# Altium schematic sheet LCD.SchDoc: HD44780 display connector
size A4; DrawnBy: Grzegorz Gajoch; Address1: Grzegorz Gajoch; Address2: grzegorz@gajoch.pl; Revision: 1
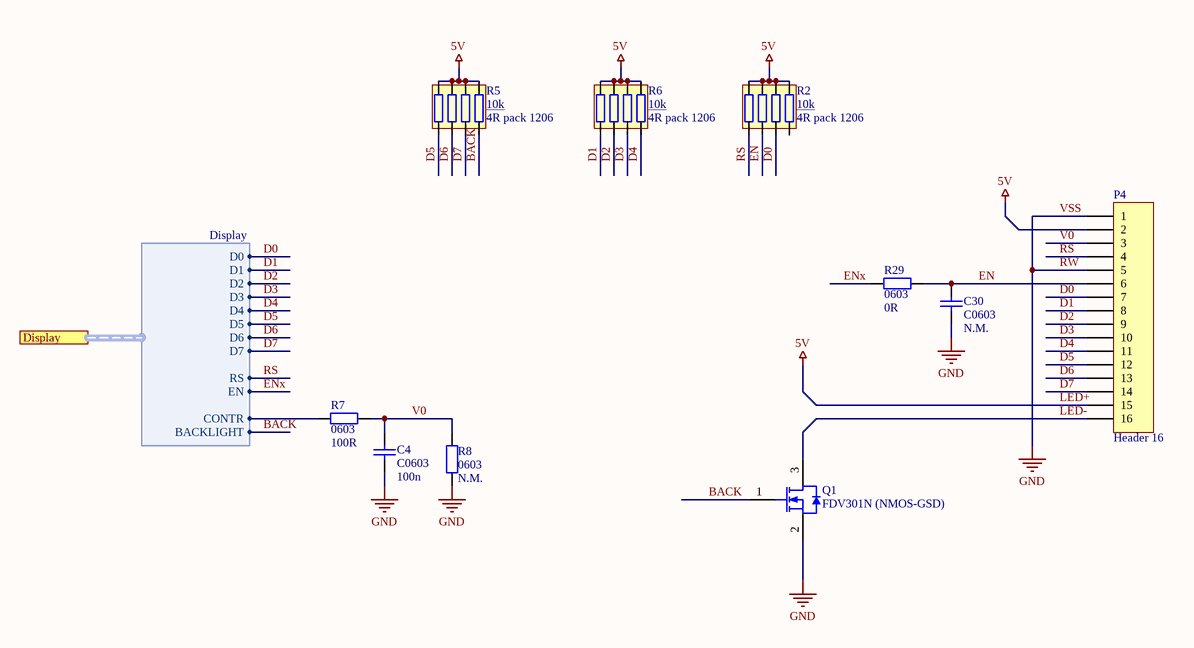
[diagram p0: LCD.SchDoc]

## Parts
C4  100n  [C0603]
C30  N.M.  [C0603]
P4  Header 16  [HEADER 1X16 Female]
Q1  FDV301N (NMOS-GSD)  [SOT-23_M]
R2  10k  [4R pack 1206]
R5  10k  [4R pack 1206]
R6  10k  [4R pack 1206]
R7  100R  [0603]
R8  N.M.  [0603]
R29  0R  [0603]

## Ports
Display (harness Display)

## Harnesses
Display: CONTR, RS, EN, D0, D1, D2, D3, D4, D5, D6, D7, BACKLIGHT

## Nets
GND: C4.2 C30.2 P4.1 P4.5 Q1.2(S) R8.2
LED+: P4.2 P4.15 R2.5 R2.6 R2.7 R2.8 R5.5 R5.6 R5.7 R5.8 R6.5 R6.6 R6.7 R6.8  [also labelled 5V]
BACK: Q1.1(G) R5.4 ; port Display.BACKLIGHT
D0: P4.7 R2.3 ; port Display.D0
D1: P4.8 R6.1 ; port Display.D1
D2: P4.9 R6.2 ; port Display.D2
D3: P4.10 R6.3 ; port Display.D3
D4: P4.11 R6.4 ; port Display.D4
D5: P4.12 R5.1 ; port Display.D5
D6: P4.13 R5.2 ; port Display.D6
D7: P4.14 R5.3 ; port Display.D7
EN: C30.1 P4.6 R2.2 R29.2
ENx: R29.1 ; port Display.EN
LED-: P4.16 Q1.3(D)
RS: P4.4 R2.1 ; port Display.RS
V0: C4.1 P4.3 R7.2 R8.1
NetR7_1: R7.1 ; port Display.CONTR

Not connected (* = marked no-connect by the designer): R2 4

## Notes on the sheet
- (near P4) VSS
- (near P4) RW
- Title
- Size:
- Date:
- A4
- Number:
- Time:
- Revision:
- Sheet
- of
- File:

## Library data of the parts
C4 C30 = Cap: Generic capacitor; Packge: C0603
  C4: Value: 100n
  C30: Value: N.M.
P4 = Header 16: Header, 16-Pin; LatestRevisionDate: 17-Jul-2002; LatestRevisionNote: Re-released for DXP Platform.; Publisher: Altium Limited
Q1 = NMOS-GSD
R2 R5 R6 = Rres_pack_4: 4 resistor pack array; Value: 10k; Package: 4R pack 1206
R7 R8 R29 = Res: Generic resistor; Package: 0603
  R7: Value: 100R
  R8: Value: N.M.
  R29: Value: 0R